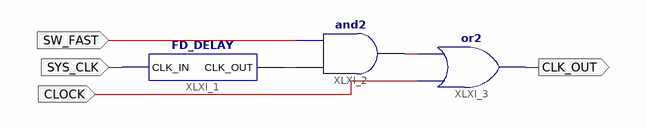
[diagram p0: schematic sheet 1]
// Xilinx ISE schematic SYS_CLK.sch (spartan3e) as structural Verilog: 3 symbols, 4 ports
module SYS_CLK (
  input  SYS_CLK,
  input  CLOCK,
  input  SW_FAST,
  output CLK_OUT
);

  wire XLXN_9, XLXN_13;

  FD_DELAY XLXI_1 (.CLK_IN(SYS_CLK), .CLK_OUT(XLXN_9));
  and XLXI_2 (XLXN_13, XLXN_9, SW_FAST);
  or XLXI_3 (CLK_OUT, CLOCK, XLXN_13);
endmodule
